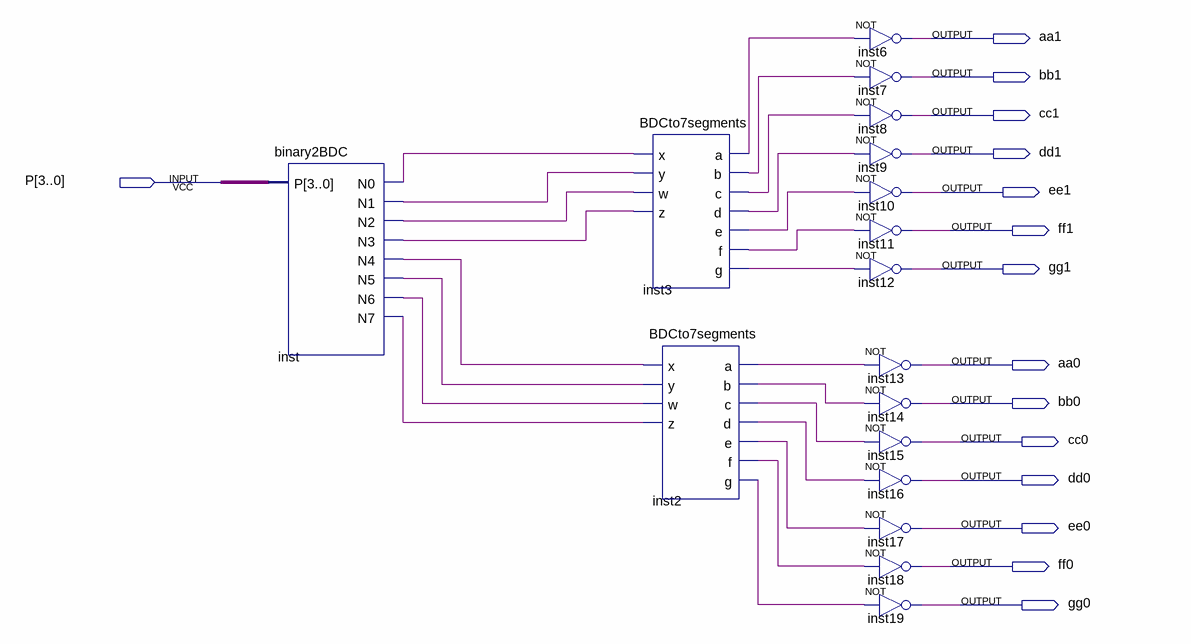
[diagram p0: schematic sheet]
// Quartus schematic display.bdf as structural Verilog: 17 symbols, 15 pins
module display (
  input  [3:0] P,
  output aa1,
  output bb1,
  output cc1,
  output dd1,
  output ee1,
  output ff1,
  output gg1,
  output aa0,
  output bb0,
  output cc0,
  output dd0,
  output ee0,
  output ff0,
  output gg0
);

  wire inst2_a, inst2_b, inst2_c, inst2_d, inst2_e, inst2_f, inst2_g, inst3_a, inst3_b, inst3_c, inst3_d,
       inst3_e, inst3_f, inst3_g, inst_n0, inst_n1, inst_n2, inst_n3, inst_n4, inst_n5, inst_n6, inst_n7;

  binary2BDC inst (
    .P(P), .N0(inst_n0), .N1(inst_n1), .N2(inst_n2), .N3(inst_n3), .N4(inst_n4), .N5(inst_n5), .N6(inst_n6),
    .N7(inst_n7));
  BDCto7segments inst3 (
    .x(inst_n0), .y(inst_n1), .w(inst_n2), .z(inst_n3), .a(inst3_a), .b(inst3_b), .c(inst3_c), .d(inst3_d),
    .e(inst3_e), .f(inst3_f), .g(inst3_g));
  BDCto7segments inst2 (
    .x(inst_n4), .y(inst_n5), .w(inst_n6), .z(inst_n7), .a(inst2_a), .b(inst2_b), .c(inst2_c), .d(inst2_d),
    .e(inst2_e), .f(inst2_f), .g(inst2_g));
  not inst6 (aa1, inst3_a);
  not inst7 (bb1, inst3_b);
  not inst8 (cc1, inst3_c);
  not inst9 (dd1, inst3_d);
  not inst10 (ee1, inst3_e);
  not inst11 (ff1, inst3_f);
  not inst12 (gg1, inst3_g);
  not inst13 (aa0, inst2_a);
  not inst14 (bb0, inst2_b);
  not inst15 (cc0, inst2_c);
  not inst16 (dd0, inst2_d);
  not inst17 (ee0, inst2_e);
  not inst18 (ff0, inst2_f);
  not inst19 (gg0, inst2_g);
endmodule
